# EAGLE design headers-160m (EAGLE 7.6.0)
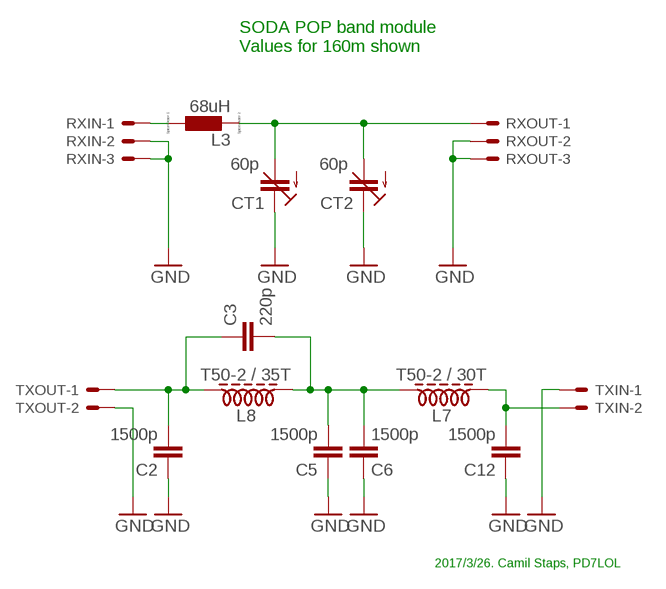
[diagram p0: schematic, sheet 1]

## Parts
C2  1500p  C5/2.5  [C5B2.5]
C3  220p  C5/2.5  [C5B2.5]
C5  1500p  C5/2.5  [C5B2.5]
C6  1500p  C5/2.5  [C5B2.5]
C12  1500p  C5/2.5  [C5B2.5]
CT1  60p  C-TRIMMTZ03  [CTRIMTZ03]
CT2  60p  C-TRIMMTZ03  [CTRIMTZ03]
L3  68uH  L0207/10  [0207/10]
L7  T50-2 / 30T  INDUCTORT30-2-28AWG-15T  [T30-2-28AWG-15T]
L8  T50-2 / 35T  INDUCTORT30-2-28AWG-15T  [T30-2-28AWG-15T]
RXIN  22-23-2031  [22-23-2031]
RXOUT  22-23-2031  [22-23-2031]
TXIN  22-23-2021  [22-23-2021]
TXOUT  22-23-2021  [22-23-2021]

## Nets
GND: C2.1 C5.1 C6.1 C12.1 CT1.1(E) CT2.1(E) RXIN.2 RXIN.3 RXOUT.2 RXOUT.3 TXIN.1 TXOUT.2
N$1: L3.1 RXIN.1
N$2: CT1.2(A) CT2.2(A) L3.2 RXOUT.1
N$5: C3.2 C5.2 C6.2 L7.P$2 L8.P$1
N$6: C12.2 L7.P$1 TXIN.2
N$8: C2.2 C3.1 L8.P$2 TXOUT.1

## Notes on the sheet
- SODA POP band module
  Values for 160m shown
- 2017/3/26. Camil Staps, PD7LOL

## Library data of the parts
C2 C3 C5 C6 C12 = capacitor-wima:C: CAPACITOR naming: grid - package width
CT1 CT2 = rcl:C-TRIMM: Trimm capacitor
L3 = eagle-ltspice:L: INDUCTOR, European symbol; SPICEMODEL: NONE; SPICEPREFIX: L
L7 L8 = toroids:INDUCTOR: Inductor on toroid
RXIN RXOUT = con-molex:22-23-2031: .100" (2.54mm) Center Header - 3 Pin; MF: MOLEX; MPN: 22-23-2031; OC_FARNELL: 1462950; OC_NEWARK: 30C0862
TXIN TXOUT = con-molex:22-23-2021: .100" (2.54mm) Center Header - 2 Pin; MF: MOLEX; MPN: 22-23-2021; OC_FARNELL: 1462926; OC_NEWARK: 25C3832

## Board
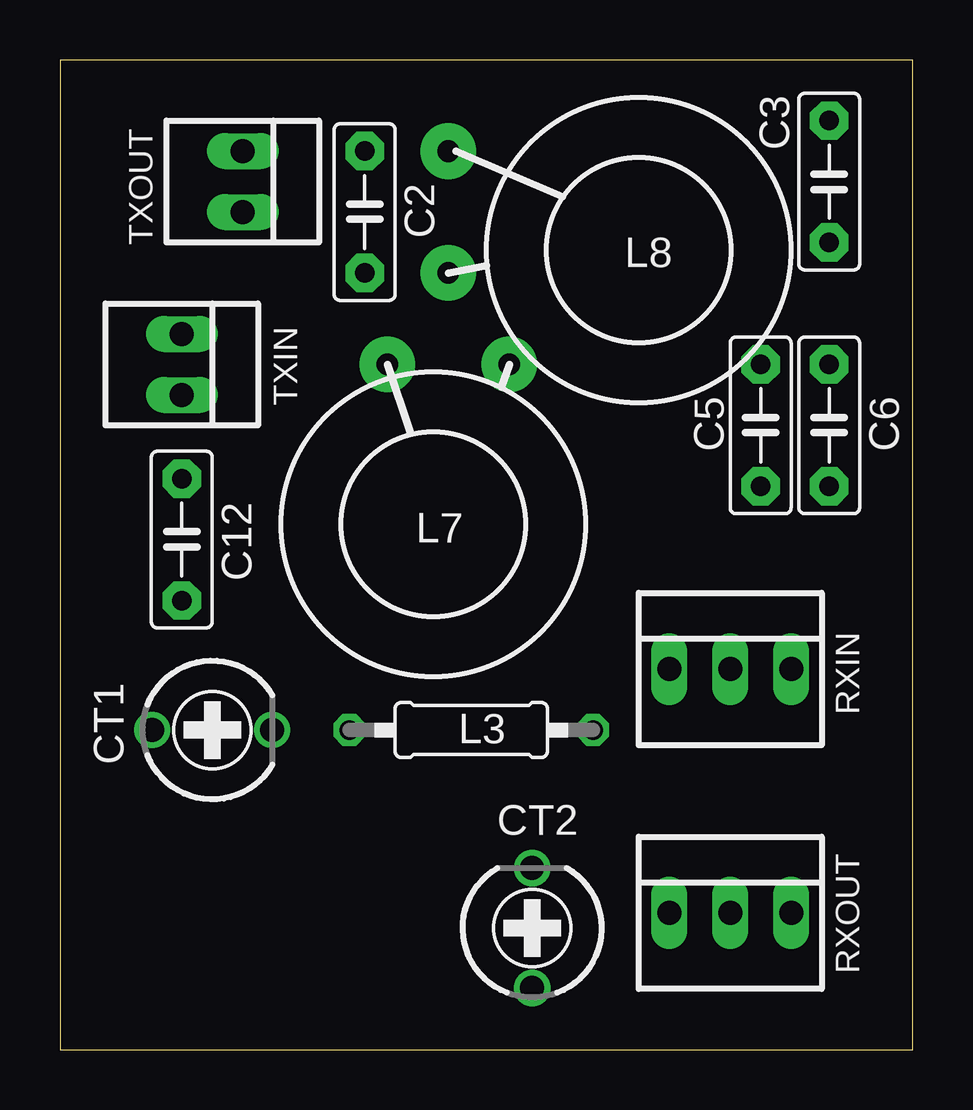
[diagram p1: board, top side]
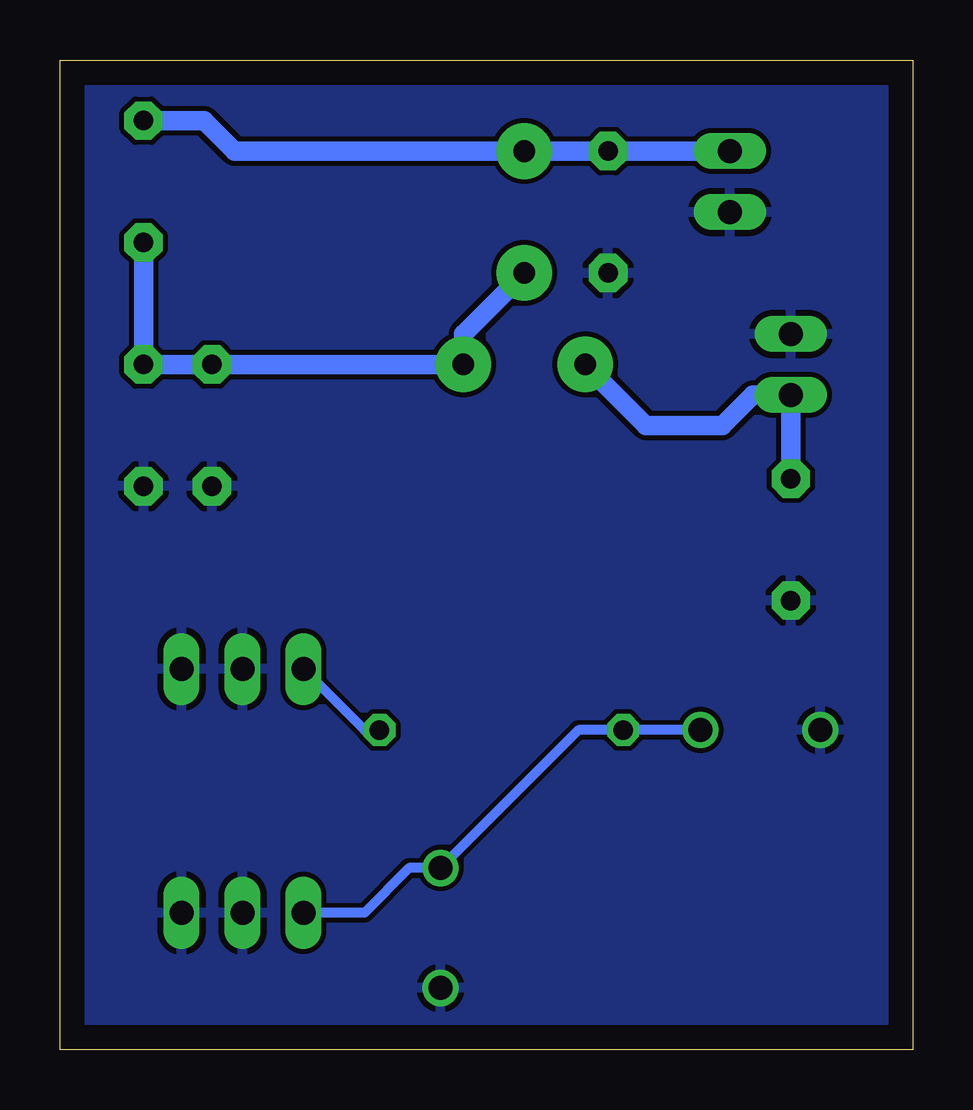
[diagram p2: board, bottom side, seen from below]

Size 35.55 x 41.27 mm. Coordinates in mm from the lower left corner, seen from the top.
Outline: 0,0 35.55,0 35.55,41.27 0,41.27 0,0
Copper layers (1*16): Top 0.035mm / dielectric 1.5mm / Bottom 0.035mm
Design rules "default": minimum track width 10mil, minimum drill 24mil, track to track 8mil, track to pad 8mil, pad to pad 8mil, via to via 8mil, smd to smd 8mil, copper to edge 40mil, drill to drill 8mil, minimum pad ring 10mil, minimum via ring 8mil, stop-mask expansion 4mil, vias tented up to drill 0mil, thermal gap 10mil

### Footprints (pad centres in the part's own frame; a part is rotated, then mirrored left to right if it is on the bottom)
C5B2.5 = drill 0.813 pad 1.6 octagon: 1 -2.54,0; 2 2.54,0
CTRIMTZ03 = drill 1: 1 0,2.5; 2 0,-2.5
0207/10 = drill 0.813 octagon: 1 -5.08,0; 2 5.08,0
T30-2-28AWG-15T = drill 0.9 pad 2.32: P$1 0,0; P$2 5.08,0
22-23-2031 = drill 1 long: 1 -2.54,0; 2 0,0; 3 2.54,0
22-23-2021 = drill 1 long: 1 -1.27,0; 2 1.27,0

### Placement (x,y rotation side)
C2  12.7,34.92 90 top
C3  32.07,36.2 270 top
C5  29.21,26.04 90 top
C6  32.07,26.04 90 top
C12  5.08,21.27 90 top
CT1  6.35,13.34 90 top
CT2  19.68,5.08 180 top
L3  17.14,13.34 180 top
L7  13.65,28.57 0 top
L8  16.19,32.38 90 top
RXIN  27.94,15.88 0 top
RXOUT  27.94,5.71 0 top
TXIN  5.08,28.57 270 top
TXOUT  7.62,36.2 270 top

### Tracks (layer width: path | path; a pad name or v marks a point on that pad's centre or on a via)
GND
  pour Bottom: 0,41.27 35.56,41.27 35.56,0 0,0
N$1
  Bottom 0.406: 24.77,15.24 RXIN.1 22.86,13.34 L3.1
N$2
  Bottom 0.406: RXOUT.1 22.86,5.71 21,7.58 CT2.2 13.93,13.34 L3.2 CT1.2
N$5
  Bottom 0.813: L8.P$1 18.73,29.84 L7.P$2 C5.2 C6.2 C3.2
N$6
  Bottom 0.813: L7.P$1 11.11,26.04 7.94,26.04 6.67,27.3 TXIN.2 C12.2
N$8
  Bottom 0.813: TXOUT.1 C2.2 L8.P$2 28.26,37.47 29.53,38.73 C3.1